# Altium schematic sheet 3_PressureSensor.SchDoc
size A4; SheetNumber: 3; SheetTotal: 5
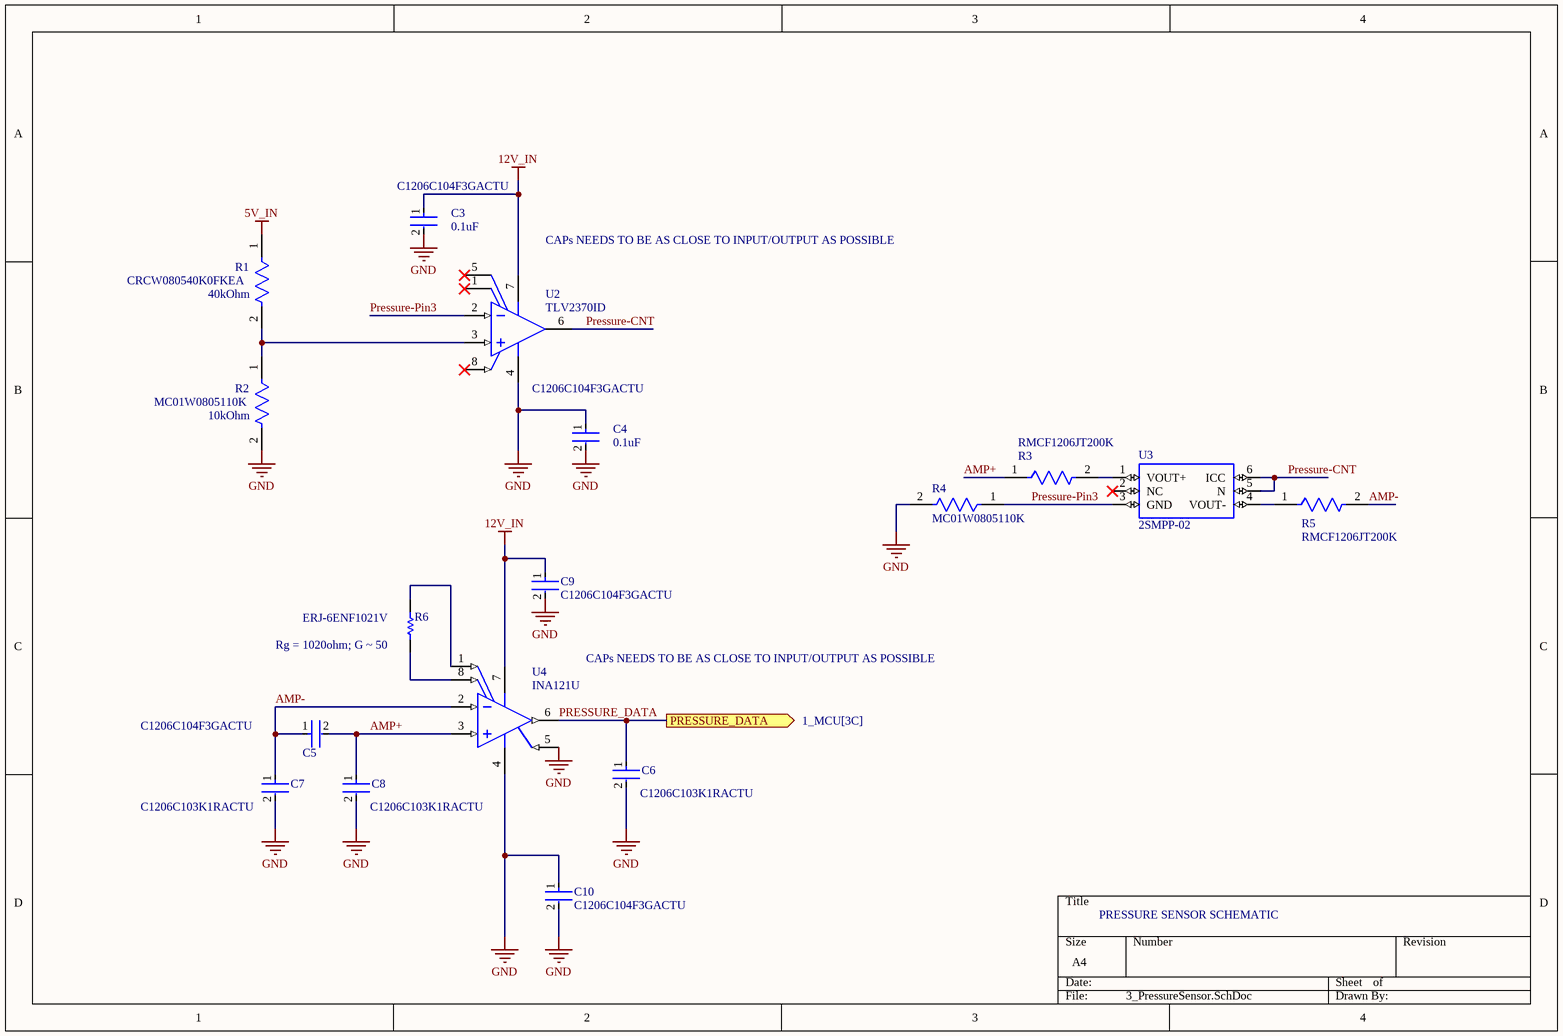
[diagram p0: 3_PressureSensor.SchDoc]

## Parts
C3  C1206C104F3GACTU  [FP-C1206C-EB-MFG]
C4  C1206C104F3GACTU  [FP-C1206C-EB-MFG]
C5  C1206C104F3GACTU  [FP-C1206C-EB-MFG]
C6  C1206C103K1RACTU  [FP-C1206C-EB-MFG]
C7  C1206C103K1RACTU  [FP-C1206C-EB-MFG]
C8  C1206C103K1RACTU  [FP-C1206C-EB-MFG]
C9  C1206C104F3GACTU  [FP-C1206C-EB-MFG]
C10  C1206C104F3GACTU  [FP-C1206C-EB-MFG]
R1  CRCW080540K0FKEA  [FP-CRCW0805-e3-MFG]
R2  MC01W0805110K  [FP-MC01W0805-IPC_C]
R3  RMCF1206JT200K  [FP-RMCF1206-IPC_C]
R4  MC01W0805110K  [FP-MC01W0805-IPC_C]
R5  RMCF1206JT200K  [FP-RMCF1206-IPC_C]
R6  ERJ-6ENF1021V  [RESC2013X70X40ML20T20]
U2  TLV2370ID  [D0008A_L]
U3  2SMPP-02  [2SMPP_PAC]
U4  INA121U  [D0008A_M]

## Ports
PRESSURE_DATA (out, see 1_MCU[3C])

## Nets
5V_IN: R1.1
12V_IN: C3.1 C9.1 U2.7(VDD) U4.7(V+)
GND: C3.2 C4.1 C4.2 C6.2 C7.2 C8.2 C9.2 C10.1 C10.2 R2.2 R4.2 U2.4(GND) U4.4(V-) U4.5(REF)
AMP+: C5.2 C8.1 R3.1 U4.3(VIN+)
AMP-: C5.1 C7.1 R5.2 U4.2(VIN-)
Pressure-CNT: U2.6(OUT) U3.5(N) U3.6(ICC)
Pressure-Pin3: R4.1 U2.2(IN-) U3.3(GND)
PRESSURE_DATA: C6.1 U4.6(VO) ; port PRESSURE_DATA
NetR1_2: R1.2 R2.1 U2.3(IN+)
NetR3_2: R3.2 U3.1(VOUT+)
NetR5_1: R5.1 U3.4(VOUT-)
NetR6_1: R6.1 U4.1(RG)
NetR6_2: R6.2 U4.8(RG)

Not connected (* = marked no-connect by the designer): U2 1(NC)* 5(NC)* 8(~{SHDN})*; U3 2(NC)*

## Notes on the sheet
- 0.1uF
- (near U2) CAPs NEEDS TO BE AS CLOSE TO INPUT/OUTPUT AS POSSIBLE
- (near R1) 40kOhm
- (near R2) 10kOhm
- (near C4) 0.1uF
- (near R6) Rg = 1020ohm; G ~ 50
- CAPs NEEDS TO BE AS CLOSE TO INPUT/OUTPUT AS POSSIBLE
- PRESSURE SENSOR SCHEMATIC

## Library data of the parts
C3-C5 C9 C10 = CMP-1037-04186-2: CAP CER 0.1UF 25V C0G/NP0 1206; Manufacturer: KEMET; Material: Ceramic; Value: 0.10 μF; Temperature Characteristic: C0G; Temperature Coefficient: 15%; Tolerance: 0.01; Automotive Grade: Grade 0; Device Class L3: Ceramic Capacitors; Voltage Rating: 25 V; Temperature Range Low: -55°C; RoHS: TRUE; Package: C1206C-EB; Category: Cap; Lead Free: Yes; Manufacturer Part Number: C1206C104F3GACTU; ComponentLink2URL: https://content.kemet.com/datasheets/KEM_C1007_X8R_ULTRA_150C_SMD.pdf; Ipc Land Pattern Name: CAPC320160X78; Temperature Range High: +150°C; Height: 0.88mm; Digikey Description: CAP CER 0.1UF 25V C0G/NP0 1206; ComponentLink2Description: Datasheet; Capacitance: 0.10 μF; Mouser Description: Multilayer Ceramic Capacitors MLCC - SMD/SMT 25volts 0.1uF 1% C0G; Octopart: https://octopart.com/c1206c104f3gactu-kemet-13149870; Device Class L1: Passive Components; Device Class L2: Capacitors; Automotive: Yes; Temperature: -55°C to +150°C
C6-C8 = CMP-03020-021723-1: Cap Ceramic 0.01uF 100V X7R 10% SMD 1206 125°C Plastic T/R; Manufacturer: KEMET; Temperature Coefficient: 15%; Tolerance: 0.1; Capacitance: 10,000 pF; Value: 10,000 pF; Automotive Grade: Grade 0; Device Class L3: Ceramic Capacitors; Ipc Land Pattern Name: CAPC320160X78; Temperature Characteristic: X7R; Material: Ceramic; Category: Cap; Device Class L2: Capacitors; RoHS: TRUE; Manufacturer Part Number: C1206C103K1RACTU; Mouser Description: Multilayer Ceramic Capacitors MLCC - SMD/SMT 100volts 10000pF X7R 10%; Octopart: https://octopart.com/c1206c103k1ractu-kemet-117927; Temperature: -55°C to +150°C; Temperature Range Low: -55°C; Lead Free: Yes; Automotive: Yes; ComponentLink2URL: https://content.kemet.com/datasheets/KEM_C1007_X8R_ULTRA_150C_SMD.pdf; Package: C1206C-EB; Voltage Rating: 100 V; Temperature Range High: +150°C; ComponentLink2Description: Datasheet; Height: 0.88mm; Device Class L1: Passive Components; Digikey Description: Cap Ceramic 0.01uF 100V X7R 10% SMD 1206 125°C Plastic T/R
R1 = CMP-02407-003498-1: RES Thick Film, 40kΩ, 1%, 0.125W, 100ppm/°C, 0805; Resistance: 40kR; Max Power Dissipation: 125mW; Tolerance: 1%; Features: Automotive AEC-Q200; Max Operating Temperature: 155°C; Composition: Thick Film; Length: 0.079inch; Case/Package: 0805; Min Operating Temperature: -55°C; Packaging: Tape and Reel; Number of Terminations: 2; Width: 0.049inch; Height: 0.02inch; Package Quantity: 5000; Lead Free: Lead Free; Temperature Coefficient: 100ppm/°C
R2 R4 = CMP-12256-000003-1: Resistor, 10K, 0.1W, 1%, 0805, Reel; Resistance: 10kR; Voltage Rating: 150V; Temperature Coefficient: 100ppm/°C; Power Rating: 100mW; REACH SVHC: No SVHC; Composition: Thick Film; Max Operating Temperature: 155°C; Case/Package: 0805; Tolerance: 1%; Number of Pins: 2; Case Code (Metric): 2012; Voltage Rating (DC): 150V; Min Operating Temperature: -55°C; Width: 1.25mm; Case Code (Imperial): 0805; Packaging: Cut Tape
R3 R5 = CMP-26527-005036-1: 200kΩ ±5% 0.25W 1206 Thick Film Chip Resistor AEC-Q200 compliant; Temperature Coefficient: 200ppm/°C; Power Rating: 250mW; Resistance: 200kR; Number of Terminations: 2; RoHS Compliant: Yes; Features: Automotive AEC-Q200; Series: RMCF; Width: 0.063inch; Lead Free: Lead Free; Case Code (Metric): 3216; Size Code: 1206; Height: 0.028inch; Length: 0.126inch; Case Code (Imperial): 1206; Mount: Surface Mount; Radiation Hardening: No; Resistor Type: Thick Film; Max Power Dissipation: 250mW; Min Operating Temperature: -55°C; Military Standard: Not; Packaging: Tape and Reel; Max Operating Temperature: 155°C; Construction: Rectangular; Contact Plating: Tin; Depth: 1.6mm; Tolerance: 5%; Case/Package: 1206
R6 = CMP-2001-04380-1: Manufacturer: Panasonic; Part Number: ERJ-6ENF1021V
U2 = CMP-0272-03086-3: 550 uA/Ch, 3 MHz, RRIO Operational Amplifier with Shutdown, 2.7 to 16 V, -40 to 125 degC, 8-pin SOIC (D8), Green (RoHS & no Sb/Br); Manufacturer: Texas Instruments; Total Supply Voltage(Max)(+5V is 5, +/-5V is 10): 16; Sub Family: Low Supply Voltage Amplifier (<=2.7V), Precision Amplifier; Number of Channels: 1; GBW(Typ)(MHz): 3; Packing: TUBE; CMRR(Min)(dB): 50; Iq per channel(Max)(mA): 0.9; Offset Drift(Typ)(uV/C): 2; Rating: Catalog; Slew Rate(Typ)(V/us): 2.4; Total Supply Voltage(Min)(+5V is 5, +/-5V is 10): 2.7; Vio (25C)(Max)(mV): 4.5; IIB(Max)(pA): 60; Code_JEDEC: MS-012; Eco-Plan: Green (RoHS & no Sb/Br); ComponentLink2Description: Datasheet; PackageVersion: 4040047-3/M, 06/2011; ComponentLink1URL: http://www.ti.com/; DatasheetVersion: SLOS270D; PackageReference: D0008A; Mounting Technology: Surface Mount; PackageDescription: 8-Pin Plastic Small Outline, Body 4.9 x 3.9 mm, Pitch 1.27 mm; ComponentLink3URL: http://www.ti.com/litv/pdf/msoi002j; PartNumber: TLV2370ID; ComponentLink1Description: Manufacturer URL; ComponentLink2URL: http://www.ti.com/lit/ds/symlink/tlv2370.pdf; ComponentLink3Description: Package Specification
U3 = CMP-007-000000-1: Pressure Sensor 5.37PSI _37kPa_ Vented Gauge Male - 0.1 _2.59mm_ Tube 0 mV ~ 31 mV 6-SMD Module; MF: Omron; Component Type: Standard; Design Item ID: 2SMPP-02; Pin Count: 6; Availability: Unavailable; Price: None; Source: SnapEDAsch.SchLib; SnapEDA_Link: https://www.snapeda.com/parts/2SMPP-02/Omron%20Electronics%20Inc-EMC%20Div/view-part/384453/?ref=snap; MP: 2SMPP-02; Package: SMD-6 Omron; Value: *
U4 = CMP-0992-00043-2: FET-Input, Low Power Instrumentation Amplifier, -40 to 85 degC, 8-pin SOIC (D8), Green (RoHS & no Sb/Br); Manufacturer: Texas Instruments; Noise at 1kHz(Typ)(nV/rt(Hz)): 20; Gain(V/V): 1 to 10000; Output Offset Drift (+/-)(Max)(uV/Degrees Celsius): 20/G; SubFamily: Dual Supply; Input Offset (+/-)(Max)(uV): 500; Quiescent Current (+/-)(Typ)(mA): 0.45; Input Bias Current (+/-)(Max)(nA): 0.05; Non-Linearity (+/-)(Max)(%): 0.005; Number of Channels: 1; Input Offset Drift (+/-)(Max)(uV/Degrees Celsius): 5; Vs(Max)(V): 36; Output Offset (+/-)(Max)(uV): 500/G; CMRR(Min)(dB): 96; Vs(Min)(V): 4.5; ComponentLink2URL: http://www.ti.com/general/docs/lit/getliterature.tsp?genericPartNumber=INA121&fileType=pdf; ComponentLink3URL: http://www.ti.com/litv/pdf/msoi002j; Code_JEDEC: MS-012; DatasheetVersion: SBOS078; Eco-Plan: Green (RoHS & no Sb/Br); PackageDescription: 8-Pin Plastic Small Outline, Body 4.9 x 3.9 mm, Pitch 1.27 mm; ComponentLink1URL: http://www.ti.com/; ComponentLink3Description: Package Specification; PackageVersion: 4040047-3/M, 06/2011; ComponentLink1Description: Manufacturer URL; Mounting Technology: Surface Mount; PackageReference: D0008A; PartNumber: INA121U; ComponentLink2Description: Datasheet